# Altium schematic sheet SYNC_BUCK_Si8233..SchDoc
size A4; Organization: Altium Limited; Address1: L3, 12a Rodborough Rd; Address2: Frenchs Forest; Address3: NSW; Address4: Australia 2086
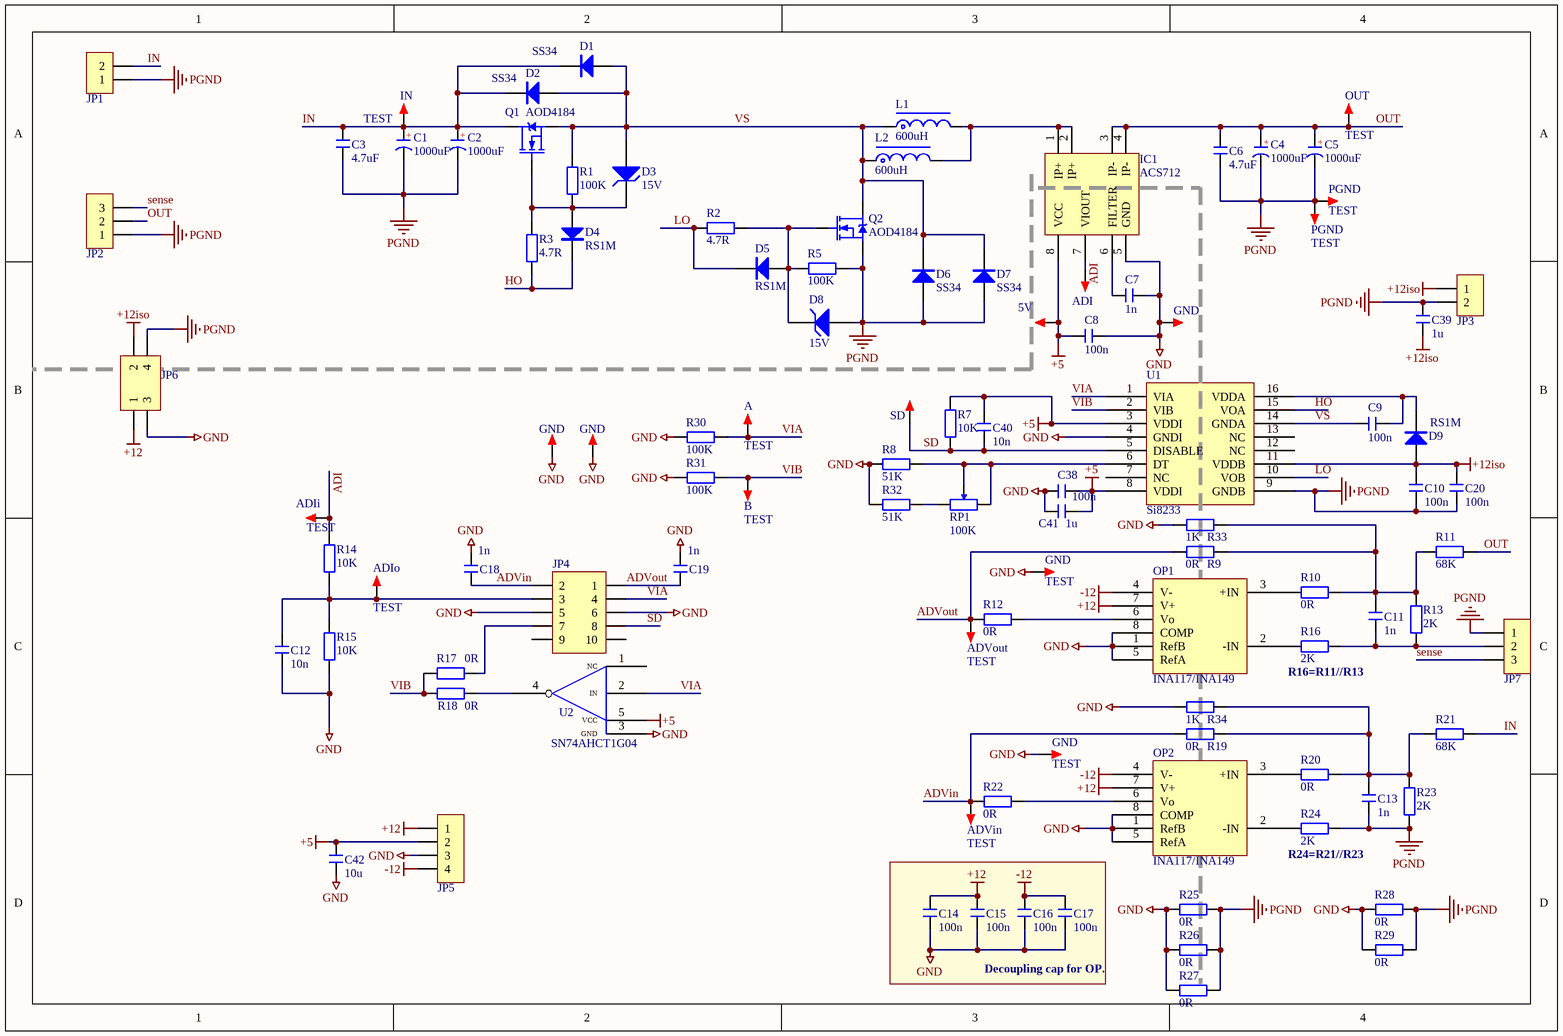
[diagram p0: SYNC_BUCK_Si8233..SchDoc]

## Parts
(Parts that share a designator on the sheet are numbered #1, #2 ... from top to bottom, then left to right.)
5V  TEST  [TEST 1.6]  (value not drawn)
A  TEST  [TEST 1.2]
ADI  TEST  [TEST 1.6]  (value not drawn)
ADIi  TEST  [TEST 1.6]
ADIo  TEST  [TEST 1.6]
ADVin  TEST  [TEST 2.4]
ADVout  TEST  [TEST 2.4]
B  TEST  [TEST 1.2]
C1  1000uF  [CAP 7.5*16*25]
C2  1000uF  [CAP 7.5*16*25]
C3  4.7uF  [CBB 25]
C4  1000uF  [CAP 7.5*16*25]
C5  1000uF  [CAP 7.5*16*25]
C6  4.7uF  [CBB 25]
C7  1n  [C 0805_L]
C8  100n  [C 0805_L]
C9  100n  [C 0805_L]
C10  100n  [C 0805_L]
C11  1n  [C 0805_L]
C12  10n  [C 0805_L]
C13  1n  [C 0805_L]
C14  100n  [C 0805_L]
C15  100n  [C 0805_L]
C16  100n  [C 0805_L]
C17  100n  [C 0805_L]
C18  1n  [C 0805_L]
C19  1n  [C 0805_L]
C20  100n  [C 0805_L]
C38  100n  [C 0805_L]
C39  1u  [C 0805_L]
C40  10n  [C 0805_L]
C41  1u  [C 0805_L]
C42  10u  [C 0805_L]
D1  SS34  [SMC]
D2  SS34  [SMA]
D3  15V  [LL41]
D4  RS1M  [SMA]
D5  RS1M  [SMA]
D6  SS34  [SMA]
D7  SS34  [SMC]
D8  15V  [LL41]
D9  RS1M  [SMA]
GND#1  TEST  [TEST 1.6]  (value not drawn)
GND#2  TEST TP  [TEST TP1.4_B]  (value not drawn)
GND#3  TEST TP  [TEST TP1.4_B]  (value not drawn)
GND#4  TEST  [TEST 2.4]
GND#5  TEST  [TEST 2.4]
IC1  ACS712  [SOP8_N]
IN  TEST  [TEST 2.4]
JP1  HDR-1X2  [KF7620-2P]  (value not drawn)
JP2  HDR-1X3  [KF7620-3P]  (value not drawn)
JP3  HDR-1X2  [KF2510-LI-2P]  (value not drawn)
JP4  Header 5X2  [IDC2.54-LI-2x5P]  (value not drawn)
JP5  HDR-1X4  [KF2510-LI-4P]  (value not drawn)
JP6  Header2X2  [HDR2.54-LI-2x2P]  (value not drawn)
JP7  HDR-1X3  [HDR2.54-LI-3P]  (value not drawn)
L1  600uH  [CS400125]
L2  600uH  [CS270125]
OP1  INA117/INA149  [SOP8_N]
OP2  INA117/INA149  [SOP8_N]
OUT  TEST  [TEST 2.4]
PGND#1  TEST  [TEST 2.4]
PGND#2  TEST  [TEST 2.4]
Q1  AOD4184  [TO252]
Q2  AOD4184  [TO252]
R1  100K  [R 0805_L]
R2  4.7R  [R 1210_L]
R3  4.7R  [R 1210_L]
R5  100K  [R 0805_L]
R7  10K  [R 0805_L]
R8  51K  [R 0805_L]
R9  0R  [R 0805_L]
R10  0R  [R 0805_L]
R11  68K  [R 0805_L]
R12  0R  [R 0805_L]
R13  2K  [R 0805_L]
R14  10K  [R 0805_L]
R15  10K  [R 0805_L]
R16  2K  [R 0805_L]
R17  0R  [R 0805_L]
R18  0R  [R 0805_L]
R19  0R  [R 0805_L]
R20  0R  [R 0805_L]
R21  68K  [R 0805_L]
R22  0R  [R 0805_L]
R23  2K  [R 0805_L]
R24  2K  [R 0805_L]
R25  0R  [R 0805_L]
R26  0R  [R 0805_L]
R27  0R  [R 0805_L]
R28  0R  [R 0805_L]
R29  0R  [R 0805_L]
R30  100K  [R 0805_L]
R31  100K  [R 0805_L]
R32  51K  [R 0805_L]
R33  1K  [R 0805_L]
R34  1K  [R 0805_L]
RP1  100K  [3303W]
SD  TEST  [TEST 1.6]  (value not drawn)
U1  Si8233  [SOP16W_N]
U2  SN74AHCT1G04  [SOT23-5N]

## Blocks framed on the sheet
Decoupling cap for OP.: C14-C17

## Nets
+5: 5V.1 C8.2 C38.1 C40.2 C41.1 C42.1 IC1.8(VCC) JP5.2 R7.2 U1.3(VDDI) U1.8(VDDI) U2.5(VCC)
+12: C14.2 C15.2 JP5.1 JP6.1 OP1.7(V+) OP2.7(V+)
+12iso: C10.2 C20.1 C39.2 D9.1(A) JP3.1 JP6.2 U1.11(VDDB)
-12: C16.2 C17.2 JP5.4 OP1.4(V-) OP2.4(V-)
GND: C7.1 C8.1 C12.1 C14.1 C15.1 C16.1 C17.1 C18.2 C19.2 C38.2 C41.2 C42.2 GND#1.1 GND#2.1 GND#3.1 GND#4.1 GND#5.1 IC1.5(GND) JP4.5 JP4.6 JP5.3 JP6.3 OP1.1(RefB) OP1.5(RefA) OP1.8(COMP) OP2.1(RefB) OP2.5(RefA) OP2.8(COMP) R8.1 R15.2 R25.1 R26.1 R27.1 R28.1 R29.1 R30.1 R31.1 R32.1 R33.1 R34.1 U1.4(GNDI) U2.3(GND)
PGND: C1.2(K) C2.2(K) C3.1 C4.2(K) C5.2(K) C6.1 C10.1 C13.1 C20.2 C39.1 D6.1(A) D7.1(A) D8.1(A) JP1.1 JP2.1 JP3.2 JP6.4 JP7.1 PGND#1.1 PGND#2.1 Q2.3(S) R5.2 R23.1 R24.2 R25.2 R26.2 R27.2 R28.2 R29.2 U1.9(GNDB)
ADI: ADI.1 ADIi.1 IC1.7(VIOUT) R14.1
ADVin: ADVin.1 C18.1 JP4.2 R19.1 R22.1
ADVout: ADVout.1 C19.1 JP4.1 R9.1 R12.1
HO: D4.2(K) R3.1 U1.15(VOA)
IN: C1.1(A) C2.1(A) C3.2 D1.2(K) D2.2(K) IN.1 JP1.2 Q1.2(D) R21.2
LO: D5.2(K) R2.2 U1.10(VOB)
OUT: C4.1(A) C5.1(A) C6.2 IC1.3(IP-) IC1.4(IP-) JP2.2 OUT.1 R11.2
SD: C40.1 JP4.8 R7.1 SD.1 U1.5(DISABLE)
sense: JP2.3 JP7.3
VIA: A.1 JP4.4 R30.2 U1.1(VIA) U2.2(IN)
VIB: B.1 R17.1 R18.1 R31.2 U1.2(VIB)
VS: C9.1 D1.1(A) D2.1(A) D3.1(A) D6.2(K) D7.2(K) L1.1 L2.1 Q1.3(S) Q2.2(D) R1.2 U1.14(GNDA)
NetADIo_1: ADIo.1 C12.2 JP4.3 R14.2 R15.1
NetC7_2: C7.2 IC1.6(FILTER)
NetC9_2: C9.2 D9.2(K) U1.16(VDDA)
NetC11_1: C11.1 JP7.2 R13.1 R16.2
NetC11_2: C11.2 R9.2 R10.2 R11.1 R13.2 R33.2
NetC13_2: C13.2 R19.2 R20.2 R21.1 R23.2 R34.2
NetD3_2: D3.2(K) D4.1(A) Q1.1(G) R1.1 R3.2
NetD5_1: D5.1(A) D8.2(K) Q2.1(G) R2.1 R5.1
NetIC1_1: IC1.1(IP+) IC1.2(IP+) L1.2 L2.2
NetJP4_7: JP4.7 R17.2
NetOP1_2: OP1.2(-IN) R16.1
NetOP1_3: OP1.3(+IN) R10.1
NetOP1_6: OP1.6(Vo) R12.2
NetOP2_2: OP2.2(-IN) R24.1
NetOP2_3: OP2.3(+IN) R20.1
NetOP2_6: OP2.6(Vo) R22.2
NetR8_2: R8.2 RP1.1 RP1.2 U1.6(DT)
NetR18_2: R18.2 U2.4
NetR32_2: R32.2 RP1.3

Not connected (* = marked no-connect by the designer): JP4 9 10; U1 7(NC) 12(NC) 13(NC); U2 1(NC)

## Notes on the sheet
- (near R16) R16=R11//R13 <v>
- (near R24) R24=R21//R23 <v>
- Title
- Size:
- Date:
- A4
- Number:
- Time:
- Revision:
- Sheet
- of
- File:
- (in symbol CE) +

## Library data of the parts
5V A ADI ADIi ADIo ADVin ADVout B GND#1 GND#4 GND#5 IN OUT PGND#1 PGND#2 SD = TEST: 测试点; 淘宝ID: 小糖豆的小窝窝; BOM名称: 测试点; 下单链接: https://item.taobao.com/item.htm?ft=t&id=613637044352
C1 C2 C4 C5 = CE: 直插电解电容; 淘宝ID: 小糖豆的小窝窝; BOM名称: 直插电解电容; 下单链接: https://item.taobao.com/item.htm?ft=t&id=613637044352
C3 C6 = CBB: CBB电容; 淘宝ID: 小糖豆的小窝窝; BOM名称: CBB电容; 下单链接: https://item.taobao.com/item.htm?ft=t&id=613637044352
C7-C20 C38-C42 = C: 贴片电容; 淘宝ID: 小糖豆的小窝窝; BOM名称: 贴片电容; 下单链接: https://item.taobao.com/item.htm?ft=t&id=613637044352
D1 D2 D4-D7 D9 = 1N4007: 整流二极管; 淘宝ID: 小糖豆的小窝窝; BOM名称: 整流二极管; 下单链接: https://item.taobao.com/item.htm?ft=t&id=613637044352
D3 D8 = D Zener: Zener Diode; Published: 8-Jun-2000; LatestRevisionDate: 17-Jul-2002; LatestRevisionNote: Re-released for DXP Platform.; PackageReference: DIODE-0.7; Publisher: Altium Limited; PackageDescription: Diode, Thru-Hole; 2 Leads; 0.7 in Pin Spacing
GND#2 GND#3 = TEST TP: 测试环; 淘宝ID: 小糖豆的小窝窝; BOM名称: 测试环; 下单链接: https://item.taobao.com/item.htm?ft=t&id=613637044352
IC1 = ACS712: 电流检测芯片; 淘宝ID: 小糖豆的小窝窝; BOM名称: 电流检测芯片; Alias1: https://item.taobao.com/item.htm?ft=t&id=613637044352
JP1 JP3 = Header 2: 2P接插件; 淘宝ID: 小糖豆的小窝窝; BOM名称: 2P接插件; 下单链接: https://item.taobao.com/item.htm?ft=t&id=613637044352
JP2 JP7 = Header 3: 3P接插件; 淘宝ID: 小糖豆的小窝窝; BOM名称: 3P接插件; 下单链接: https://item.taobao.com/item.htm?ft=t&id=613637044352
JP4 = Header 5X2: 5*2P接插件; 淘宝ID: 小糖豆的小窝窝; BOM名称: 5*2P接插件; 下单链接: https://item.taobao.com/item.htm?ft=t&id=613637044352
JP5 = Header 4: 4P接插件; 淘宝ID: 小糖豆的小窝窝; BOM名称: 4P接插件; 下单链接: https://item.taobao.com/item.htm?ft=t&id=613637044352
JP6 = Header 2X2: 2*2P接插件; 淘宝ID: 小糖豆的小窝窝; BOM名称: 2*2P接插件; 下单链接: https://item.taobao.com/item.htm?ft=t&id=613637044352
L1 L2 = L-MR: 功率磁环电感; 淘宝ID: 小糖豆的小窝窝; BOM名称: 功率磁环电感; 下单链接: https://item.taobao.com/item.htm?ft=t&id=613637044352
OP1 OP2 = INA117
Q1 Q2 = IRF3710: N沟场效应管; 淘宝ID: 小糖豆的小窝窝; BOM名称: N沟场效应管; 下单链接: https://item.taobao.com/item.htm?ft=t&id=613637044352
R1-R3 R5 R7-R34 = R: 贴片电阻; 淘宝ID: 小糖豆的小窝窝; BOM名称: 贴片电阻; 下单链接: https://item.taobao.com/item.htm?ft=t&id=613637044352
RP1 = RP-SMD: 贴片电位器; 淘宝ID: 小糖豆的小窝窝; BOM名称: 贴片电位器; 下单链接: https://item.taobao.com/item.htm?ft=t&id=613637044352
U1 = Si8230/3: Two inputs HS/LS isolated driver
U2 = SN74LVC1G04